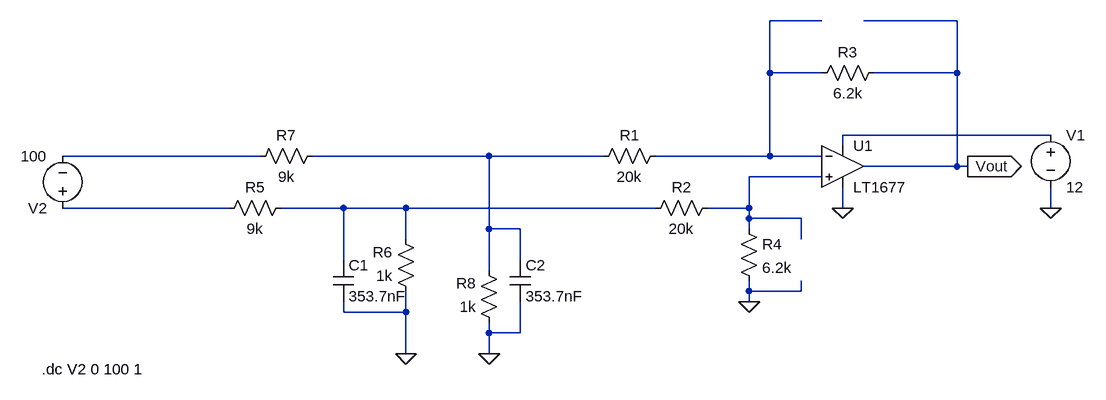
[diagram p0: schematic Voltage Sense Diff Amp_LPF.asc]
Voltage Sense Diff Amp_LPF.asc, the LTspice schematic file:
Version 4
SHEET 1 880 680
WIRE 160 -32 80 -32
WIRE 368 -32 224 -32
WIRE 80 48 80 -32
WIRE 160 48 80 48
WIRE 368 48 368 -32
WIRE 368 48 240 48
WIRE 512 144 192 144
WIRE 192 160 192 144
WIRE -704 176 -1008 176
WIRE -352 176 -624 176
WIRE -176 176 -352 176
WIRE 80 176 80 48
WIRE 80 176 -96 176
WIRE 160 176 80 176
WIRE 368 192 368 48
WIRE 368 192 224 192
WIRE 384 192 368 192
WIRE 160 208 48 208
WIRE -752 256 -1008 256
WIRE -576 256 -672 256
WIRE -480 256 -576 256
WIRE -96 256 -480 256
WIRE 48 256 48 208
WIRE 48 256 -16 256
WIRE 192 256 192 224
WIRE 512 256 512 224
WIRE 48 272 48 256
WIRE 128 272 48 272
WIRE -352 288 -352 176
WIRE -304 288 -352 288
WIRE 48 288 48 272
WIRE -480 304 -480 256
WIRE 128 304 128 272
WIRE -576 336 -576 256
WIRE -304 336 -304 288
WIRE -352 352 -352 288
WIRE 48 384 48 368
WIRE 128 384 128 368
WIRE 128 384 48 384
WIRE 48 400 48 384
WIRE -576 416 -576 400
WIRE -480 416 -480 384
WIRE -480 416 -576 416
WIRE -352 448 -352 432
WIRE -304 448 -304 400
WIRE -304 448 -352 448
WIRE -480 480 -480 416
WIRE -352 480 -352 448
FLAG 48 400 0
FLAG 192 256 0
FLAG 512 256 0
FLAG 384 192 Vout
IOPIN 384 192 Out
FLAG -480 480 0
FLAG -352 480 0
SYMBOL res 144 64 R270
WINDOW 0 32 56 VTop 2
WINDOW 3 0 56 VBottom 2
SYMATTR InstName R3
SYMATTR Value 6.2k
SYMBOL res 32 272 R0
SYMATTR InstName R4
SYMATTR Value 6.2k
SYMBOL voltage 512 128 R0
WINDOW 123 0 0 Left 0
WINDOW 39 0 0 Left 0
SYMATTR InstName V1
SYMATTR Value 12
SYMBOL res -608 160 R90
WINDOW 0 0 56 VBottom 2
WINDOW 3 32 56 VTop 2
SYMATTR InstName R7
SYMATTR Value 9k
SYMBOL res -336 448 R180
WINDOW 0 36 76 Left 2
WINDOW 3 36 40 Left 2
SYMATTR InstName R8
SYMATTR Value 1k
SYMBOL voltage -1008 272 R180
WINDOW 123 0 0 Left 0
WINDOW 39 0 0 Left 0
SYMATTR InstName V2
SYMATTR Value 100
SYMBOL res -80 160 R90
WINDOW 0 0 56 VBottom 2
WINDOW 3 32 56 VTop 2
SYMATTR InstName R1
SYMATTR Value 20k
SYMBOL res 0 240 R90
WINDOW 0 0 56 VBottom 2
WINDOW 3 32 56 VTop 2
SYMATTR InstName R2
SYMATTR Value 20k
SYMBOL res -656 240 R90
WINDOW 0 0 56 VBottom 2
WINDOW 3 32 56 VTop 2
SYMATTR InstName R5
SYMATTR Value 9k
SYMBOL res -464 400 R180
WINDOW 0 36 76 Left 2
WINDOW 3 36 40 Left 2
SYMATTR InstName R6
SYMATTR Value 1k
SYMBOL Opamps\\LT1677 192 128 R0
SYMATTR InstName U1
SYMBOL cap -592 336 R0
SYMATTR InstName C1
SYMATTR Value 353.7nF
SYMBOL cap -320 336 R0
SYMATTR InstName C2
SYMATTR Value 353.7nF
TEXT -1040 504 Left 2 !.dc V2 0 100 1

The netlist it stands for:
* Voltage Sense Diff Amp_LPF.asc
R3 N001 Vout 6.2k
R4 N005 0 6.2k
V1 N002 0 12
R7 N004 N003 9k
R8 0 N004 1k
V2 N006 N003 100
R1 N001 N004 20k
R2 N005 N007 20k
R5 N007 N006 9k
R6 0 N007 1k
XU1 N005 N001 N002 0 Vout LT1677  ; pins In+ In- V+ V- OUT
C1 N007 0 353.7nF
C2 N004 0 353.7nF
.dc V2 0 100 1
.lib LTC.lib
.backanno
.end